# Altium schematic sheet cpu.SchDoc
size B
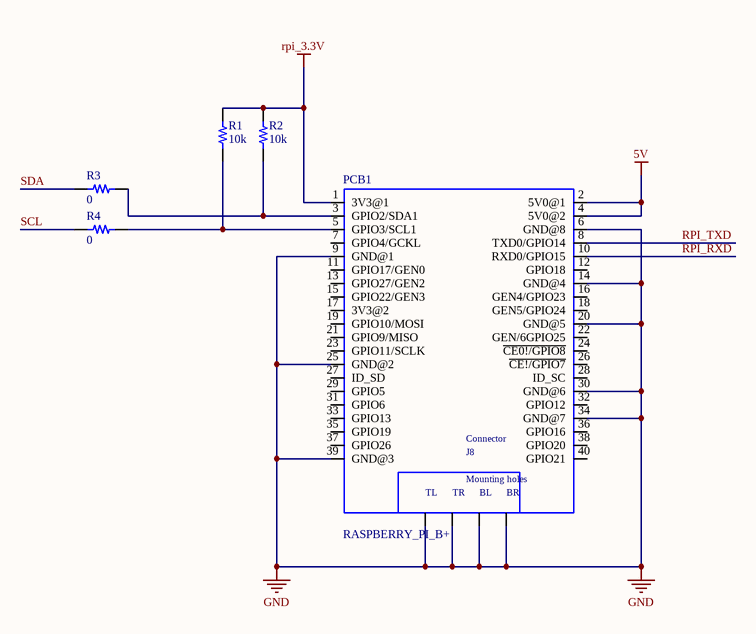
[diagram p0: cpu.SchDoc]

## Parts
PCB1  RASPBERRY_PI_B+  [RASPBERRY_PI_B+]
R1  10k  [RES 0603_1608]
R2  10k  [RES 0603_1608]
R3  0  [RES 0603_1608]
R4  0  [RES 0603_1608]

## Nets
5V: PCB1.2(5V0@1) PCB1.4(5V0@2)
GND: PCB1.6(GND@8) PCB1.9(GND@1) PCB1.14(GND@4) PCB1.20(GND@5) PCB1.25(GND@2) PCB1.30(GND@6) PCB1.34(GND@7) PCB1.39(GND@3) PCB1.PE_BL(BL) PCB1.PE_BR(BR) PCB1.PE_TL(TL) PCB1.PE_TR(TR)
rpi_3.3V: PCB1.1(3V3@1) R1.1 R2.1
RPI_RXD: PCB1.10(RXD0/GPIO15)
RPI_TXD: PCB1.8(TXD0/GPIO14)
SCL: R4.1
SDA: R3.1
NetPCB1_3: PCB1.3(GPIO2/SDA1) R2.2 R3.2
NetPCB1_5: PCB1.5(GPIO3/SCL1) R1.2 R4.2

Not connected (* = marked no-connect by the designer): PCB1 7(GPIO4/GCKL) 11(GPIO17/GEN0) 12(GPIO18) 13(GPIO27/GEN2) 15(GPIO22/GEN3) 16(GEN4/GPIO23) 17(3V3@2) 18(GEN5/GPIO24) 19(GPIO10/MOSI) 21(GPIO9/MISO) 22(GEN/6GPIO25) 23(GPIO11/SCLK) 24(~{CE0!/GPIO8}) 26(~{CE!/GPIO7}) 27(ID_SD) 28(ID_SC) 29(GPIO5) 31(GPIO6) 32(GPIO12) 33(GPIO13) 35(GPIO19) 36(GPIO16) 37(GPIO26) 38(GPIO20) 40(GPIO21)

## Notes on the sheet
- Title
- Size:
- Date:
- B
- Number:
- Time:
- Revision:
- Sheet
- of
- Maptix Co.,Ltd
- 99/193 Atoll Bali Beach
- Khlong Luang Phaeng
- Chacheongsao
- Thailand 24000
- File:
- (in symbol RASPBERRY_PI_B+) Connector; J8; Mounting holes

## Library data of the parts
PCB1 = RASPBERRY_PI_B+: BCM2835 Raspberry Pi Model B+ - ARM11, VideoCore MPU Embedded Evaluation Board; MP: RASPBERRY PI B+; Package: None; Availability: Unavailable; Value: *; SnapEDA_Link: https://www.snapeda.com/parts/RASPBERRY%20PI%20B%2B/Raspberry%20Pi/view-part/559759/?ref=snap; Price: None; MF: Raspberry Pi
R1-R4 = CRCW060329K4FKEA: Resistor; Manufacturer: Vishay Dale; Power (Watts): 0.1W, 1/10W; Resistance: 29.4 kOhms; Temperature Coefficient: ±100ppm/°C; Tolerance: ±1%; Part Number: CRCW060329K4FKEA; ComponentLink1Description: Datasheet; ComponentLink1URL: http://www.vishay.com/docs/20035/dcrcwe3.pdf; ComponentLink2Description: DigiKey Link; ComponentLink2URL: http://digikey.com/product-detail/en/vishay-dale/CRCW060329K4FKEA/541-29.4KHCT-ND/1179975; Composition: Thick Film; Device Package: 0603 (1608 Metric); Features: Automotive AEC-Q200; Height - Seated (Max): 0.020" (0.50mm); LastUpdated: 1/2/2020 12:06:58 AM; Lifecycle Status: Active; Minimum Order: 1; Number of Terminations: 2; Operating Temperature: -55°C ~ 155°C; Package / Case: 0603 (1608 Metric); Packaging: TapeAndReel; PartId: 7975; Part Status: Active; Price: 0.00; Ratings: AEC-Q200; Series: CRCW; Size / Dimension: 0.061" L x 0.033" W (1.55mm x 0.85mm); Supplier 1: DigiKey; Supplier Part Number 1: 541-29.4KHCT-ND; Supplier Device Package: 0603
  R1 R2: Value: 10k
  R3 R4: Value: 0